# Altium schematic sheet Display.SchDoc: 7 szegmenses kijelző
size A4; Author: Tabajdi Máté; Organization: BME - AUT; DocumentNumber: 3; Revision: 19.; SheetNumber: 3; SheetTotal: 3
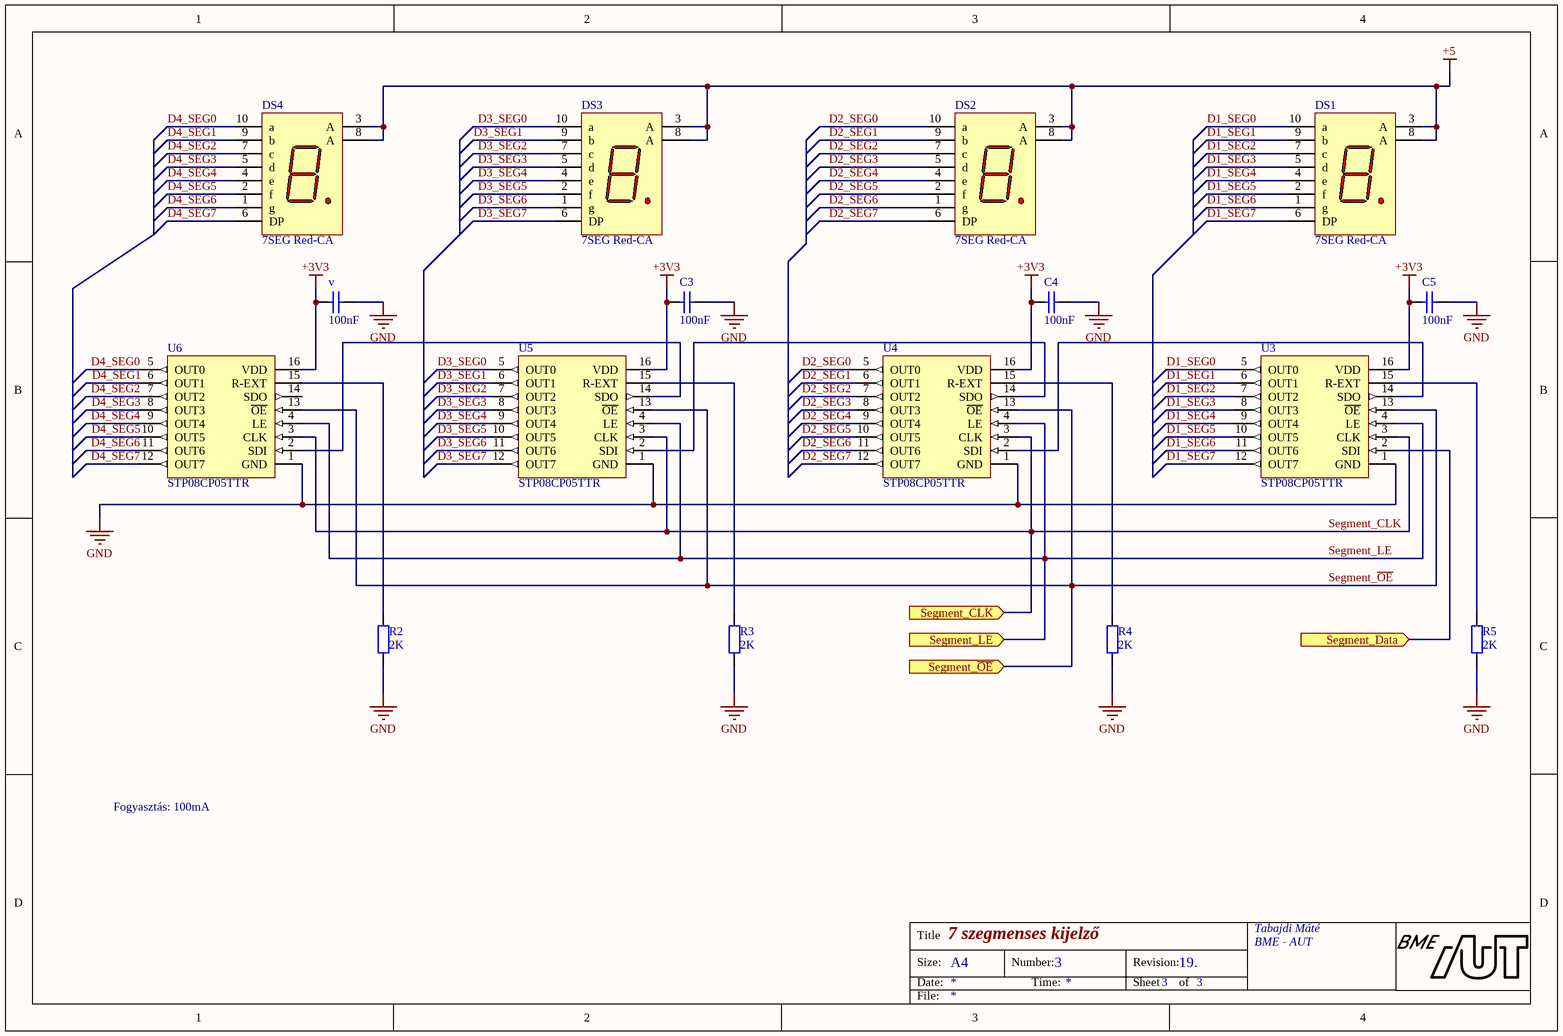
[diagram p0: Display.SchDoc]

## Parts
C3  100nF  [FP_0805_CAP_085]
C4  100nF  [FP_0805_CAP_085]
C5  100nF  [FP_0805_CAP_085]
DS1  7SEG Red-CA  [FP_7SEG]
DS2  7SEG Red-CA  [FP_7SEG]
DS3  7SEG Red-CA  [FP_7SEG]
DS4  7SEG Red-CA  [FP_7SEG]
R2  2K  [FP_0805_RES]
R3  2K  [FP_0805_RES]
R4  2K  [FP_0805_RES]
R5  2K  [FP_0805_RES]
U3  STP08CP05TTR  [TSOP65P640X120-16M]
U4  STP08CP05TTR  [TSOP65P640X120-16M]
U5  STP08CP05TTR  [TSOP65P640X120-16M]
U6  STP08CP05TTR  [TSOP65P640X120-16M]
v  100nF  [FP_0805_CAP_085]

## Ports
Segment_CLK (in), Segment_Data (in), Segment_LE (in), Segment_~{OE} (in)

## Nets
+3V3: C3.2 C4.2 C5.2 U3.16(VDD) U4.16(VDD) U5.16(VDD) U6.16(VDD) v.2
+5: DS1.3(A) DS1.8(A) DS2.3(A) DS2.8(A) DS3.3(A) DS3.8(A) DS4.3(A) DS4.8(A)
GND: C3.1 C4.1 C5.1 R2.1 R3.1 R4.1 R5.1 U3.1(GND) U4.1(GND) U5.1(GND) U6.1(GND) v.1
D1_SEG0: DS1.10(a) U3.5(OUT0)
D1_SEG1: DS1.9(b) U3.6(OUT1)
D1_SEG2: DS1.7(c) U3.7(OUT2)
D1_SEG3: DS1.5(d) U3.8(OUT3)
D1_SEG4: DS1.4(e) U3.9(OUT4)
D1_SEG5: DS1.2(f) U3.10(OUT5)
D1_SEG6: DS1.1(g) U3.11(OUT6)
D1_SEG7: DS1.6(DP) U3.12(OUT7)
D2_SEG0: DS2.10(a) U4.5(OUT0)
D2_SEG1: DS2.9(b) U4.6(OUT1)
D2_SEG2: DS2.7(c) U4.7(OUT2)
D2_SEG3: DS2.5(d) U4.8(OUT3)
D2_SEG4: DS2.4(e) U4.9(OUT4)
D2_SEG5: DS2.2(f) U4.10(OUT5)
D2_SEG6: DS2.1(g) U4.11(OUT6)
D2_SEG7: DS2.6(DP) U4.12(OUT7)
D3_SEG0: DS3.10(a) U5.5(OUT0)
D3_SEG1: DS3.9(b) U5.6(OUT1)
D3_SEG2: DS3.7(c) U5.7(OUT2)
D3_SEG3: DS3.5(d) U5.8(OUT3)
D3_SEG4: DS3.4(e) U5.9(OUT4)
D3_SEG5: DS3.2(f) U5.10(OUT5)
D3_SEG6: DS3.1(g) U5.11(OUT6)
D3_SEG7: DS3.6(DP) U5.12(OUT7)
D4_SEG0: DS4.10(a) U6.5(OUT0)
D4_SEG1: DS4.9(b) U6.6(OUT1)
D4_SEG2: DS4.7(c) U6.7(OUT2)
D4_SEG3: DS4.5(d) U6.8(OUT3)
D4_SEG4: DS4.4(e) U6.9(OUT4)
D4_SEG5: DS4.2(f) U6.10(OUT5)
D4_SEG6: DS4.1(g) U6.11(OUT6)
D4_SEG7: DS4.6(DP) U6.12(OUT7)
Segment_CLK: U3.3(CLK) U4.3(CLK) U5.3(CLK) U6.3(CLK) ; port Segment_CLK
Segment_Data: U3.2(SDI) ; port Segment_Data
Segment_LE: U3.4(LE) U4.4(LE) U5.4(LE) U6.4(LE) ; port Segment_LE
Segment_~{OE}: U3.13(~{OE}) U4.13(~{OE}) U5.13(~{OE}) U6.13(~{OE}) ; port Segment_~{OE}
NetR2_2: R2.2 U6.15(R-EXT)
NetR3_2: R3.2 U5.15(R-EXT)
NetR4_2: R4.2 U4.15(R-EXT)
NetR5_2: R5.2 U3.15(R-EXT)
NetU3_14: U3.14(SDO) U4.2(SDI)
NetU4_14: U4.14(SDO) U5.2(SDI)
NetU5_14: U5.14(SDO) U6.2(SDI)

Not connected (* = marked no-connect by the designer): U6 14(SDO)

## Notes on the sheet
- Fogyasztás: 100mA
- Title
- Size:
- Date:
- A4
- Number:
- Time:
- Revision:
- Sheet
- of
- File:

## Library data of the parts
C3-C5 v = CAP: Capacitor; Tolerance: 10%; Voltage: 50V; Name: 100nF 0805 10% 50V X7R 0805B104K500NT (FNG); Supplier: Lomex; Reference: 82-13-46; Value: 100nF
DS1 = 7SEG Red-CA: 7-Segment Display: CA, RH DP; MinimumIntensity: 360 ucd; Note: IF = 5 mA; Colour: High Efficiency Red (HER); Note: Pins 1 and 6 are redundant Anodes.; Name: FYS-3911BUHR-21; Parameter 1: FYS-3911BUHR-21 (FYL) 7 SEG SRED COM.AN. 10mm 30mcd 10x13x7mm 640nm; Published: 8-Jun-2000; LatestRevisionDate: 17-Dec-2003; LatestRevisionNote: Schematic revised, PCB Footprint replaced.; DatasheetVersion: 19-Feb-2002; PackageVersion: 11-Feb-2002; PackageReference: A; Publisher: Altium Limited; PackageDescription: LED, 7-Segment Display, 7.62 mm, RHD; 10 Leads; Row Space 5.08 mm; Pitch 2.54 mm; ComponentLink1Description: Manufacturer Link; ComponentLink1URL: http://www.agilent.com/; Supplier: Lomex; Reference: 35-03-94
DS2-DS4 = 7SEG Red-CA: 7-Segment Display: CA, RH DP; MinimumIntensity: 360 ucd; Note: IF = 5 mA; Colour: High Efficiency Red (HER); Note: Pins 1 and 6 are redundant Anodes.; Name: FYS-3911BUHR-21 (FYL) 7 SEG SRED COM.AN. 10mm 30mcd 10x13x7mm 640nm; Published: 8-Jun-2000; LatestRevisionDate: 17-Dec-2003; LatestRevisionNote: Schematic revised, PCB Footprint replaced.; DatasheetVersion: 19-Feb-2002; PackageVersion: 11-Feb-2002; PackageReference: A; Publisher: Altium Limited; PackageDescription: LED, 7-Segment Display, 7.62 mm, RHD; 10 Leads; Row Space 5.08 mm; Pitch 2.54 mm; ComponentLink1Description: Manufacturer Link; ComponentLink1URL: http://www.agilent.com/; Supplier: Lomex; Reference: 35-03-94
R2-R5 = RES: Resistor; Tolerance: 5%; Power: 0.125W; Name: 2K00 0805 5% CR-05JL7----2K 0.125W (VIK); Supplier: Lomex; Reference: 81-11-90; Value: 2K
U3-U6 = STP08CP05TTR: Low voltage, low current power 8-bit shift register; Supplier: Tanszéki forrás; Reference: STP08CP05TTR; Name: STP08CP05TTR